# EAGLE schematic LOCO-Sensor (EAGLE 9.5.2)

## Sheet 1 of 2
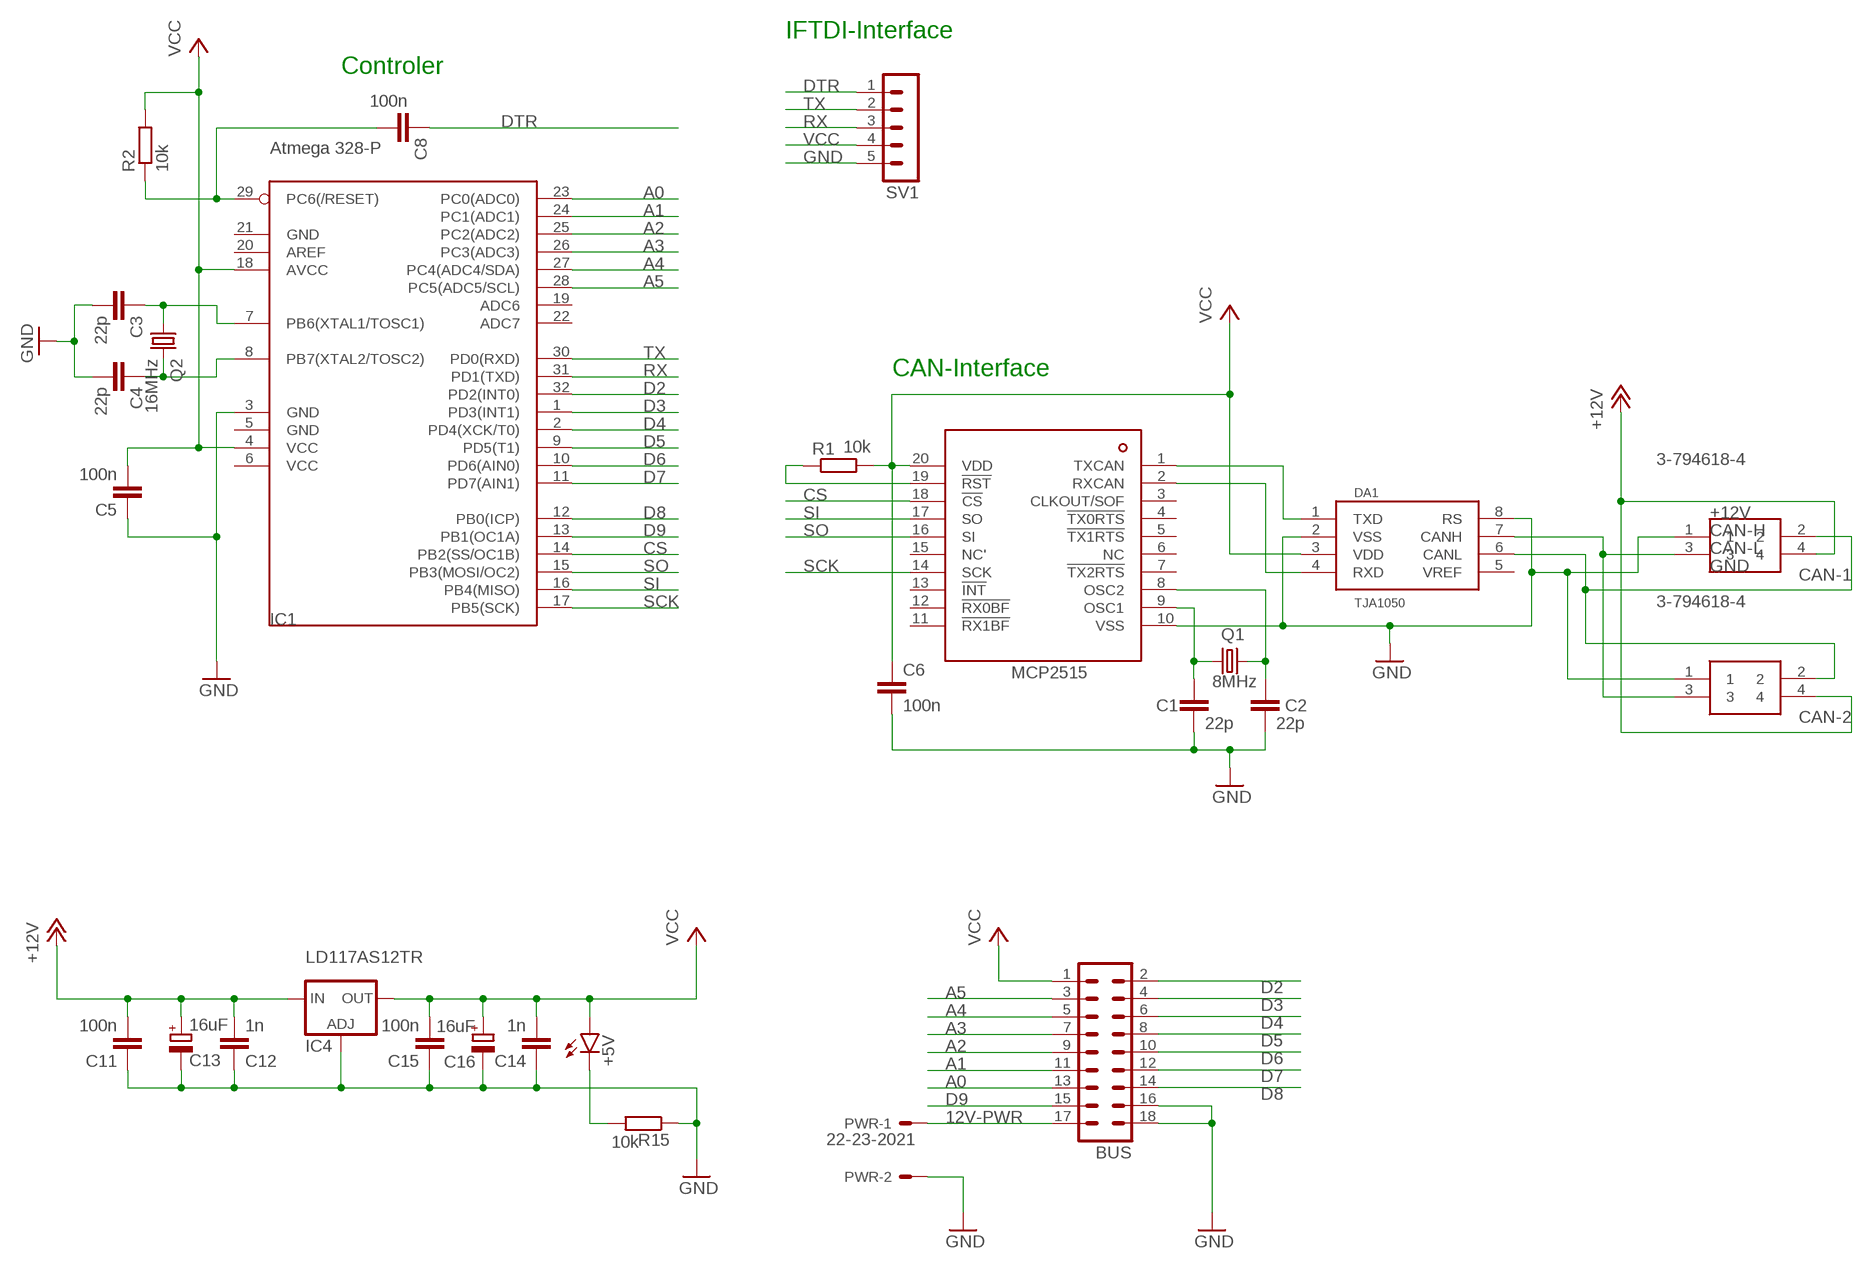
[diagram p0: schematic, sheet 1]

### Parts
+5V  LEDCHIP-LED0603  [CHIP-LED0603]
BUS  MA09-2  [MA09-2]
C1  22p  C-EUC0402K  [C0402K]
C2  22p  C-EUC0402K  [C0402K]
C3  22p  C-EUC0402K  [C0402K]
C4  22p  C-EUC0402K  [C0402K]
C5  100n  C-EUC0402K  [C0402K]
C6  100n  C-EUC0402K  [C0402K]
C8  100n  C-EUC0402K  [C0402K]
C11  100n  C-EUC0402K  [C0402K]
C12  1n  C-EUC0402K  [C0402K]
C13  16uF  CPOL-EUA/3216-18W  [A/3216-18W]
C14  1n  C-EUC0402K  [C0402K]
C15  100n  C-EUC0402K  [C0402K]
C16  16uF  CPOL-EUA/3216-18W  [A/3216-18W]
CAN-1  3-794618-4  [SHDRRA4W102P300_2X2_686X892X73]
CAN-2  3-794618-4  [SHDRRA4W102P300_2X2_686X892X73]
DA1  TJA1050  [SO08]
IC1  Atmega 328-P  MEGA8-AI  [TQFP32-08]
IC2  MCP2515  [TSSOP20]
IC4  LD117AS12TR  [SOT223]
PWR  22-23-2021  [22-23-2021]
Q1  8MHz  CRYSTALHC49S  [HC49/S]
Q2  16MHz  CRYSTALHC49S  [HC49/S]
R1  10k  R-EU_MELF0102W  [MINI_MELF-0102W]
R2  10k  R-EU_MELF0102W  [MINI_MELF-0102W]
R15  10k  R-EU_MELF0102W  [MINI_MELF-0102W]
SV1  MA05-1  [MA05-1]

### Nets
12V-PWR: BUS.17 PWR.1
+12V: C11.2 C12.2 C13.+ CAN-1.4 CAN-2.4 IC4.3(IN)
A0: BUS.13 IC1.23(PC0(ADC0))
A1: BUS.11 IC1.24(PC1(ADC1))
A2: BUS.9 IC1.25(PC2(ADC2))
A3: BUS.7 IC1.26(PC3(ADC3))
A4: BUS.5 IC1.27(PC4(ADC4/SDA))
A5: BUS.3 IC1.28(PC5(ADC5/SCL))
CAN-H: CAN-1.3 CAN-2.3 DA1.7(CANH)
CAN-L: CAN-1.2 CAN-2.2 DA1.6(CANL)
CAN-OCC1: C1.1 IC2.9(OSC1) Q1.1
CAN-OCC2: C2.1 IC2.8(OSC2) Q1.2
CS: IC1.14(PB2(SS/OC1B)) IC2.18(!CS)
D2: BUS.2 IC1.32(PD2(INT0))
D3: BUS.4 IC1.1(PD3(INT1))
D4: BUS.6 IC1.2(PD4(XCK/T0))
D5: BUS.8 IC1.9(PD5(T1))
D6: BUS.10 IC1.10(PD6(AIN0))
D7: BUS.12 IC1.11(PD7(AIN1))
D8: BUS.14 IC1.12(PB0(ICP))
D9: BUS.15 IC1.13(PB1(OC1A))
DTR: C8.1 SV1.1
GND: BUS.16 BUS.18 C1.2 C2.2 C3.2 C4.2 C5.1 C6.2 C11.1 C12.1 C13.- C14.1 C15.1 C16.- CAN-1.1 CAN-2.1 DA1.2(VSS) DA1.8(RS) IC1.3(GND) IC2.10(VSS) IC4.1(ADJ) PWR.2 R15.1 SV1.5
N$6: IC2.19(!RST) R1.1
N$10: C3.1 IC1.7(PB6(XTAL1/TOSC1)) Q2.1
N$11: C4.1 IC1.8(PB7(XTAL2/TOSC2)) Q2.2
N$12: +5V.C R15.2
N$15: C8.2 IC1.29(PC6(/RESET)) R2.1
RX: IC1.31(PD1(TXD)) SV1.3
RXCAN: DA1.4(RXD) IC2.2(RXCAN)
SCK: IC1.17(PB5(SCK)) IC2.14(SCK)
SI: IC1.16(PB4(MISO)) IC2.17(SO)
SO: IC1.15(PB3(MOSI/OC2)) IC2.16(SI)
TX: IC1.30(PD0(RXD)) SV1.2
TXCAN: DA1.1(TXD) IC2.1(TXCAN)
VCC: +5V.A BUS.1 C5.2 C6.1 C14.2 C15.2 C16.+ DA1.3(VDD) IC1.4(VCC) IC1.18(AVCC) IC2.20(VDD) IC4.4(OUT) R1.2 R2.2 SV1.4
Unconnected: DA1.5(VREF) IC1.19(ADC6) IC1.20(AREF) IC1.22(ADC7) IC2.3(CLKOUT/SOF) IC2.4(!TX0RTS) IC2.5(!TX1RTS) IC2.6(NC) IC2.7(!TX2RTS) IC2.11(!RX1BF) IC2.12(!RX0BF) IC2.13(!INT) IC2.15(NC')

### Notes on the sheet
- IFTDI-Interface
- Controler
- CAN-Interface

## Sheet 2 of 2

## Power pins joined to a net without a drawn wire
GND: IC1.5(GND) IC1.21(GND)
VCC: IC1.6(VCC)

## Library data of the parts
+5V = led:LED: LED OSRAM: - CHIPLED LG R971, LG N971, LY N971, LG Q971, LY Q971, LO R971, LY R971 LH N974, LH R974 LS Q976, LO Q976, LY Q976 LO Q996 - Hyper CHIPLED LW Q18S LB Q993, LB Q99A, LB R99A - SideLED LS A670, LO A670, LY A670, LG A670, LP A670 LB A673, LV A673, LT A673, LW A673 LH A674 LY A675 LS A676, LA A676, LO A676, LY A676, LW A676 LS A679, LY A679, LG A679 - Hyper Micro SIDELED® LS Y876, LA Y876, LO Y876, LY Y876 LT Y87S - SmartLED LW L88C, LW L88S LB L89C, LB L89S, LG L890 LS L89K, LO L89K, LY L89K LS L896, LA L896, LO L896, LY L896 - TOPLED LS T670, LO T670, LY T670, LG T670, LP T670 LSG T670, LSP T670, LSY T670, LOP T670, LYG T670 LG T671, LOG T671, LSG T671 LB T673, LV T673, LT T673, LW T673 LH T674 LS T676, LA T676, LO T676, LY T676, LB T676, LH T676, LSB T676, LW T676 LB T67C, LV T67C, LT T67C, LS T67K, LO T67K, LY T67K, LW E67C LS E67B, LA E67B, LO E67B, LY E67B, LB E67C, LV E67C, LT E67C LW T67C LS T679, LY T679, LG T679 LS T770, LO T770, LY T770, LG T770, LP T770 LB T773, LV T773, LT T773, LW T773 LH T774 LS E675, LA E675, LY E675, LS T675 LS T776, LA T776, LO T776, LY T776, LB T776 LHGB T686 LT T68C, LB T68C - Hyper Mini TOPLED® LB M676 - Mini TOPLED Santana® LG M470 LS M47K, LO M47K, LY M47K Source: http://www.osram.convergy.de LUXEON: - LUMILED® LXK2-PW12-R00, LXK2-PW12-S00, LXK2-PW14-U00, LXK2-PW14-V00 LXK2-PM12-R00, LXK2-PM12-S00, LXK2-PM14-U00 LXK2-PE12-Q00, LXK2-PE12-R00, LXK2-PE12-S00, LXK2-PE14-T00, LXK2-PE14-U00 LXK2-PB12-K00, LXK2-PB12-L00, LXK2-PB12-M00, LXK2-PB14-N00, LXK2-PB14-P00, LXK2-PB14-Q00 LXK2-PR12-L00, LXK2-PR12-M00, LXK2-PR14-Q00, LXK2-PR14-R00 LXK2-PD12-Q00, LXK2-PD12-R00, LXK2-PD12-S00 LXK2-PH12-R00, LXK2-PH12-S00 LXK2-PL12-P00, LXK2-PL12-Q00, LXK2-PL12-R00 Source: www.luxeon.com KINGBRIGHT: KA-3528ASYC Source: www.kingbright.com
BUS = con-lstb:MA09-2: PIN HEADER; OC_FARNELL: unknown; OC_NEWARK: unknown
C1-C6 C8 C11 C12 C14 C15 = rcl:C-EU: CAPACITOR, European symbol; SPICEPREFIX: C
C13 C16 = rcl:CPOL-EU: POLARIZED CAPACITOR, European symbol; SPICEPREFIX: C
CAN-1 CAN-2 = SamacSys_Parts:3-794618-4: 4 way 2 row r/a header Mate-N-Lok Source: Datasheet <https://rs.componentsearchengine.com/Datasheets/2/3-794618-4.pdf>; DESCRIPTION: 4 way 2 row r/a header Mate-N-Lok; HEIGHT: 7.37mm; MANUFACTURER_NAME: TE Connectivity; MANUFACTURER_PART_NUMBER: 3-794618-4
DA1 = TJA1050:TJA1050: High speed CAN transceiver Input levels compatible with 3.3 V and 5 V devices 5V supply
IC1 = atmel:MEGA8: MICROCONTROLLER 8 Kbytes FLASH, 1 kbytes SRAM, 512 bytes EEPROM, USART, 6-channel 10 bit ADC, 2-channel 8 bit ADC Pin compatible with Atmega48, ATMega88, ATMega168 Source: avr.lbr; MPN: ATMEGA8-16AU; OC_FARNELL: 9171371; OC_NEWARK: 73M8863
IC2 = mcp2514:MCP2515: Microchip Technology’s MCP2515 is a stand-alone Controller Area Network (CAN) controller that implements the CAN specification, version 2.0B. It is capable of transmitting and receiving both standard and extended data and remote frames. The MCP2515 has two acceptance masks and six acceptance filters that are used to filter out unwanted messages, thereby reducing the host MCUs overhead. The MCP2515 interfaces with microcontrollers (MCUs) via an industry standard Serial Peripheral Interface (SPI).
IC4 = v-reg:LD117A?*: Low drop fixed and adjustable positive voltage regulators 1 A Source: http://www.st.com/stonline/products/literature/ds/7194/ld1117axx.pdf
PWR = con-molex:22-23-2021: .100" (2.54mm) Center Header - 2 Pin; MF: MOLEX; MPN: 22-23-2021; OC_FARNELL: 1462926; OC_NEWARK: 25C3832
Q1 Q2 = crystal:CRYSTAL: CRYSTAL; OC_FARNELL: 1667008; OC_NEWARK: unknown
R1 R2 R15 = rcl:R-EU_: RESISTOR, European symbol; SPICEPREFIX: R
SV1 = con-lstb:MA05-1: PIN HEADER; OC_FARNELL: unknown; OC_NEWARK: unknown